# Altium project VISB1.PrjPcb (part 2 of 2)
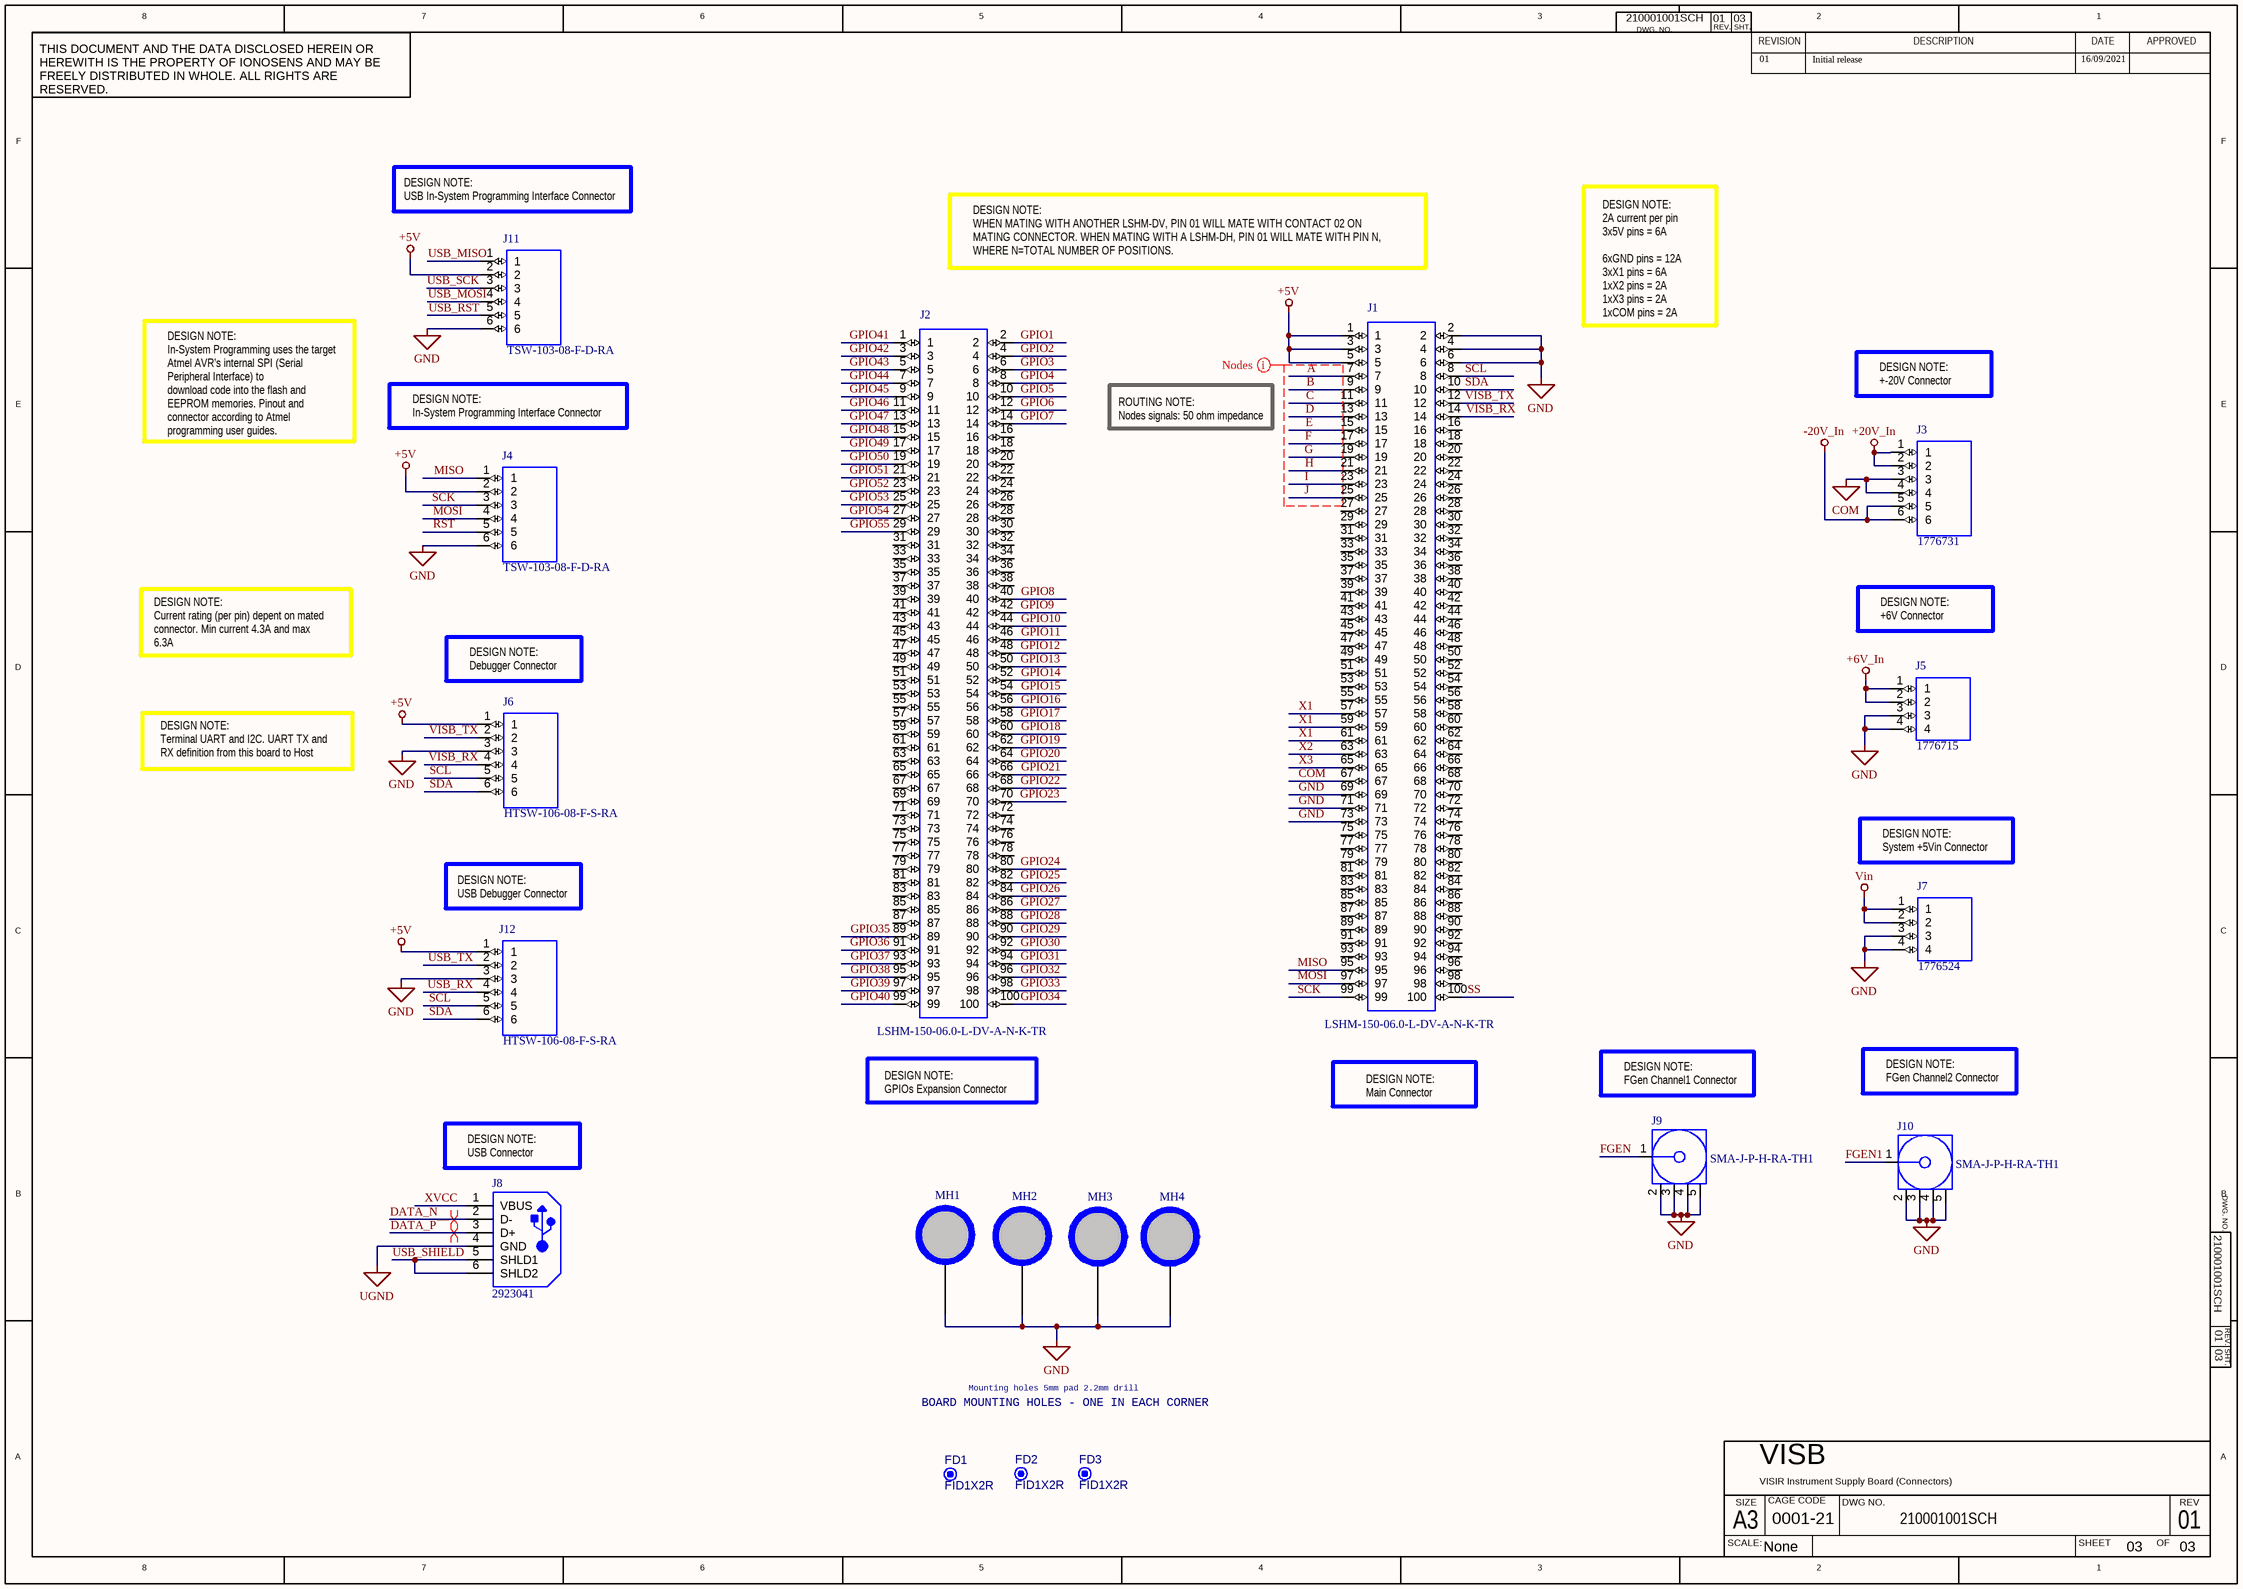
[diagram p3: Sheet3.SchDoc]

## Nets that join several sheets
+5V: Sheet1 (44 pins), Sheet2 (42 pins), Sheet3 (7 pins)
+6V: Sheet1 (D6.3 D8.2 F4.2), Sheet2 (5 pins)
+6V_In: Sheet1 (F4.1), Sheet3 (J5.1 J5.2)
+20V: Sheet1 (D2.3 D3.1 F2.2), Sheet2 (K4.4)
+20V_In: Sheet1 (F2.1), Sheet3 (J3.1 J3.2)
-20V: Sheet1 (D4.1 D4.2 D5.2 F3.2), Sheet2 (K5.4)
-20V_In: Sheet1 (F3.1), Sheet3 (J3.5 J3.6)
COM: Sheet1 (5 pins), Sheet2 (K2.4 K21.4), Sheet3 (J1.67 J3.3 J3.4)
GND: Sheet1 (58 pins), Sheet2 (16 pins), Sheet3 (26 pins)
UGND: Sheet1 (7 pins), Sheet3 (J8.4)
VIN: Sheet1 (7 pins), Sheet3 (J7.1 J7.2)
A: Sheet2 (K1.4 K6.4), Sheet3 (J1.7)
B: Sheet2 (K7.4 K16.4), Sheet3 (J1.9)
C: Sheet2 (K8.4), Sheet3 (J1.11)
COIL1: Sheet1 (U4.11), Sheet2 (D14.1 K1.3)
COIL2: Sheet1 (U1.14), Sheet2 (D20.1 K2.3)
COIL3: Sheet1 (U1.13), Sheet2 (D26.1 K3.3)
COIL4: Sheet1 (U1.12), Sheet2 (D32.1 K4.3)
COIL5: Sheet1 (U1.11), Sheet2 (D15.1 K5.3)
COIL6: Sheet1 (U1.10), Sheet2 (D21.1 K6.3)
COIL7: Sheet1 (U4.16), Sheet2 (D27.1 K7.3)
COIL8: Sheet1 (U4.15), Sheet2 (D16.1 K8.3)
COIL9: Sheet1 (U4.14), Sheet2 (D22.1 K9.3)
COIL10: Sheet1 (U4.13), Sheet2 (D28.1 K10.3)
COIL11: Sheet1 (U4.12), Sheet2 (D33.1 K11.3)
COIL12: Sheet1 (U1.15), Sheet2 (D17.1 K12.3)
COIL13: Sheet1 (U1.16), Sheet2 (D23.1 K13.3)
COIL14: Sheet1 (U5.10), Sheet2 (D29.1 K14.3)
COIL15: Sheet1 (U5.11), Sheet2 (D18.1 K15.3)
COIL16: Sheet1 (U4.10), Sheet2 (D24.1 K16.3)
COIL17: Sheet1 (U5.12), Sheet2 (D30.1 K17.3)
COIL18: Sheet1 (U5.13), Sheet2 (D34.1 K18.3)
COIL19: Sheet1 (U5.14), Sheet2 (D19.1 K19.3)
COIL20: Sheet1 (U5.15), Sheet2 (D25.1 K20.3)
COIL21: Sheet1 (U5.16), Sheet2 (D31.1 K21.3)
D: Sheet2 (K9.4), Sheet3 (J1.13)
DATA_N: Sheet1 (R2.1 Z1.1), Sheet3 (J8.2)
DATA_P: Sheet1 (R3.1 Z2.1), Sheet3 (J8.3)
E: Sheet2 (K10.4), Sheet3 (J1.15)
F: Sheet2 (K11.4), Sheet3 (J1.17)
FGEN: Sheet2 (K1.1), Sheet3 (J9.1)
FGEN1: Sheet2 (K16.1), Sheet3 (J10.1)
G: Sheet2 (K12.4), Sheet3 (J1.19)
GPIO1: Sheet1 (U3.9), Sheet3 (J2.2)
GPIO2: Sheet1 (U3.8), Sheet3 (J2.4)
GPIO3: Sheet1 (U3.7), Sheet3 (J2.6)
GPIO4: Sheet1 (U3.6), Sheet3 (J2.8)
GPIO5: Sheet1 (U3.5), Sheet3 (J2.10)
GPIO6: Sheet1 (U3.4), Sheet3 (J2.12)
GPIO7: Sheet1 (U3.1), Sheet3 (J2.14)
GPIO8: Sheet1 (U3.97), Sheet3 (J2.40)
GPIO9: Sheet1 (U3.96), Sheet3 (J2.42)
GPIO10: Sheet1 (U3.95), Sheet3 (J2.44)
GPIO11: Sheet1 (U3.94), Sheet3 (J2.46)
GPIO12: Sheet1 (U3.93), Sheet3 (J2.48)
GPIO13: Sheet1 (U3.92), Sheet3 (J2.50)
GPIO14: Sheet1 (U3.91), Sheet3 (J2.52)
GPIO15: Sheet1 (U3.90), Sheet3 (J2.54)
GPIO16: Sheet1 (U3.89), Sheet3 (J2.56)
GPIO17: Sheet1 (U3.88), Sheet3 (J2.58)
GPIO18: Sheet1 (U3.87), Sheet3 (J2.60)
GPIO19: Sheet1 (U3.86), Sheet3 (J2.62)
GPIO20: Sheet1 (U3.85), Sheet3 (J2.64)
GPIO21: Sheet1 (U3.84), Sheet3 (J2.66)
GPIO22: Sheet1 (U3.83), Sheet3 (J2.68)
GPIO23: Sheet1 (U3.82), Sheet3 (J2.70)
GPIO24: Sheet1 (U3.77), Sheet3 (J2.80)
GPIO25: Sheet1 (U3.76), Sheet3 (J2.82)
GPIO26: Sheet1 (U3.78), Sheet3 (J2.84)
GPIO27: Sheet1 (U3.79), Sheet3 (J2.86)
GPIO28: Sheet1 (U3.75), Sheet3 (J2.88)
GPIO29: Sheet1 (U3.74), Sheet3 (J2.90)
GPIO30: Sheet1 (U3.73), Sheet3 (J2.92)
GPIO31: Sheet1 (U3.72), Sheet3 (J2.94)
GPIO32: Sheet1 (U3.71), Sheet3 (J2.96)
GPIO33: Sheet1 (U3.70), Sheet3 (J2.98)
GPIO34: Sheet1 (U3.69), Sheet3 (J2.100)
GPIO35: Sheet1 (U3.68), Sheet3 (J2.89)
GPIO36: Sheet1 (U3.67), Sheet3 (J2.91)
GPIO37: Sheet1 (U3.66), Sheet3 (J2.93)
GPIO38: Sheet1 (U3.65), Sheet3 (J2.95)
GPIO39: Sheet1 (U3.64), Sheet3 (J2.97)
GPIO40: Sheet1 (U3.63), Sheet3 (J2.99)
GPIO41: Sheet1 (U3.35), Sheet3 (J2.1)
GPIO42: Sheet1 (U3.36), Sheet3 (J2.3)
GPIO43: Sheet1 (U3.37), Sheet3 (J2.5)
GPIO44: Sheet1 (U3.38), Sheet3 (J2.7)
GPIO45: Sheet1 (U3.39), Sheet3 (J2.9)
GPIO46: Sheet1 (U3.40), Sheet3 (J2.11)
GPIO47: Sheet1 (U3.41), Sheet3 (J2.13)
GPIO48: Sheet1 (U3.42), Sheet3 (J2.15)
GPIO49: Sheet1 (U3.52), Sheet3 (J2.17)
GPIO50: Sheet1 (U3.53), Sheet3 (J2.19)
GPIO51: Sheet1 (U3.54), Sheet3 (J2.21)
GPIO52: Sheet1 (U3.55), Sheet3 (J2.23)
GPIO53: Sheet1 (U3.56), Sheet3 (J2.25)
GPIO54: Sheet1 (U3.57), Sheet3 (J2.27)
GPIO55: Sheet1 (U3.58), Sheet3 (J2.29)
H: Sheet2 (K13.4), Sheet3 (J1.21)
I: Sheet2 (K14.4), Sheet3 (J1.23)
J: Sheet2 (K15.4), Sheet3 (J1.25)
MISO: Sheet1 (U3.22), Sheet3 (J1.95 J4.1)
MOSI: Sheet1 (U3.21), Sheet3 (J1.97 J4.4)
RST: Sheet1 (R1.1 U3.30), Sheet3 (J4.5)
SCK: Sheet1 (U3.20), Sheet3 (J1.99 J4.3)
SCL: Sheet1 (R6.1 U2.18 U3.43 U6.5), Sheet3 (J1.8 J6.5 J12.5)
SDA: Sheet1 (R4.1 U2.19 U3.44 U6.6), Sheet3 (J1.10 J6.6 J12.6)
SS: Sheet1 (U3.19), Sheet3 (J1.100)
USB_MISO: Sheet1 (U2.11), Sheet3 (J11.1)
USB_MOSI: Sheet1 (U2.10), Sheet3 (J11.4)
USB_RST: Sheet1 (R7.1 U2.13), Sheet3 (J11.5)
USB_RX: Sheet1 (U2.20), Sheet3 (J12.4)
USB_SCK: Sheet1 (U2.9), Sheet3 (J11.3)
USB_SHIELD: Sheet1 (L1.1), Sheet3 (J8.5 J8.6)
USB_TX: Sheet1 (U2.21), Sheet3 (J12.2)
VISB_RX: Sheet1 (U3.2), Sheet3 (J1.14 J6.4)
VISB_TX: Sheet1 (U3.3), Sheet3 (J1.12 J6.2)
X1: Sheet2 (5 pins), Sheet3 (J1.57 J1.59 J1.61)
X2: Sheet2 (K4.1), Sheet3 (J1.63)
X3: Sheet2 (K5.1), Sheet3 (J1.65)
XVCC: Sheet1 (F1.1), Sheet3 (J8.1)